# EAGLE design HM11 Breakout (EAGLE 9.6.2)
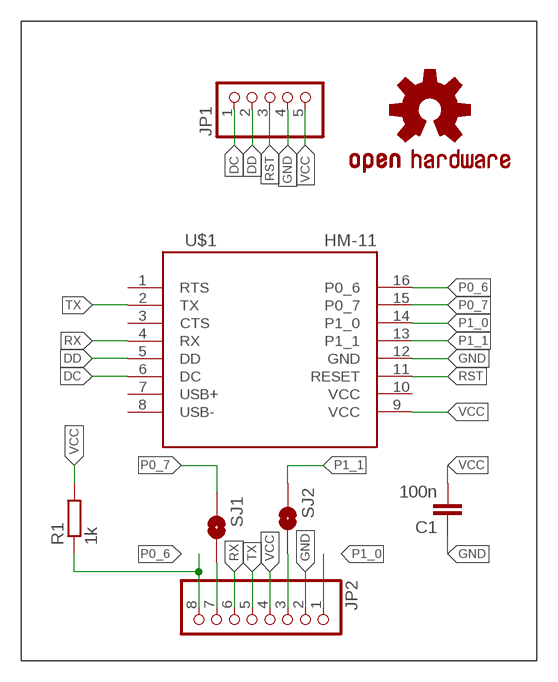
[diagram p0: schematic, sheet 1]

## Parts
C1  100n  C-EU1206  [1206]
JP1  PINHD-1X5  [1X05]
JP2  PINHD-1X8  [1X08]
LOGO1  OSHW-LOGOM  [OSHW-LOGO-M]
R1  1k  R-EU_R1206  [R1206]
SJ1  SOLDERJUMPERTRACE  [SJ_2S-TRACE]
SJ2  SOLDERJUMPERTRACE  [SJ_2S-TRACE]
U$1  HM-11  [HM-11]

## Nets
DC: JP1.1 U$1.6(DC)
DD: JP1.2 U$1.5(DD)
GND: C1.1 JP1.4 JP2.2 U$1.12(GND)
N$1: JP2.7 SJ1.1
N$6: JP2.3 SJ2.1
P0_6: JP2.8 R1.1 U$1.16(P0_6)
P0_7: SJ1.2 U$1.15(P0_7)
P1_0: JP2.1 U$1.14(P1_0)
P1_1: SJ2.2 U$1.13(P1_1)
RST: JP1.3 U$1.11(RESET)
RX: JP2.6 U$1.4(RX)
TX: JP2.5 U$1.2(TX)
VCC: C1.2 JP1.5 JP2.4 R1.2 U$1.9(VCC)
Unconnected: U$1.1(RTS) U$1.3(CTS) U$1.7(USB+) U$1.8(USB-) U$1.10(VCC)

## Library data of the parts
C1 = Master 2016:C-EU: CAPACITOR, European symbol
JP1 = pinhead:PINHD-1X5: PIN HEADER
JP2 = pinhead:PINHD-1X8: PIN HEADER
LOGO1 = Master 2016:OSHW-LOGO: Open Source Hardware Logo This logo indicates the piece of hardware it is found on incorporates a OSHW license and/or adheres to the definition of open source hardware found here: http://freedomdefined.org/OSHW
R1 = rcl:R-EU_: RESISTOR, European symbol; SPICEPREFIX: R
SJ1 SJ2 = Master 2016:SOLDERJUMPER: Solder Jumper Standard SMD solder jumper. Used to automate production. Two varients : Normally Open and Normally Closed are the same, but have different paste layers. NC will have a large amount of paste and should jumper during reflow.
U$1 = SMD Stamp Modules:HM-11

## Board
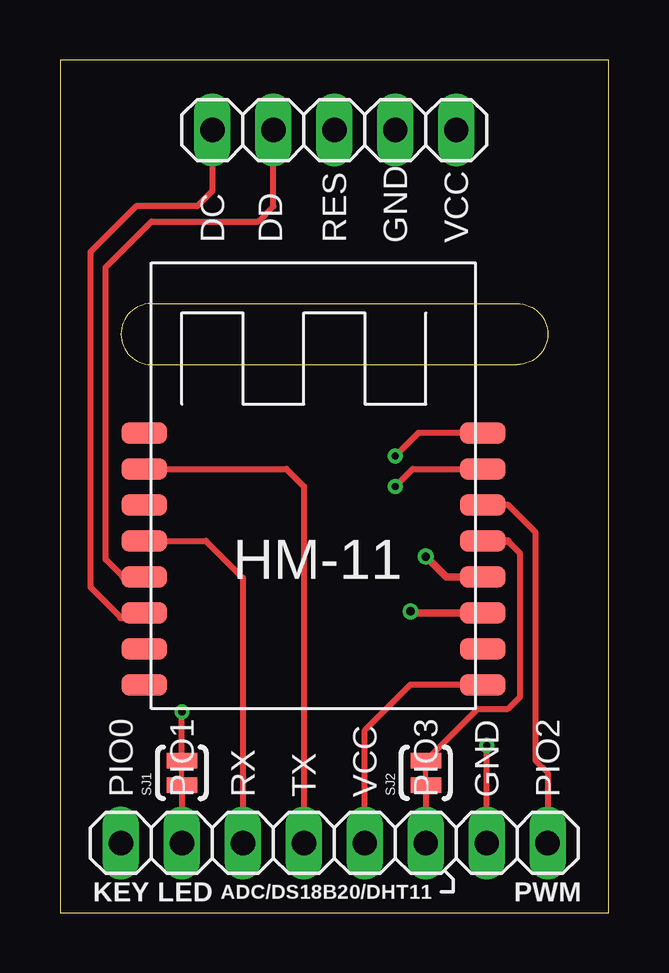
[diagram p1: board, top side]
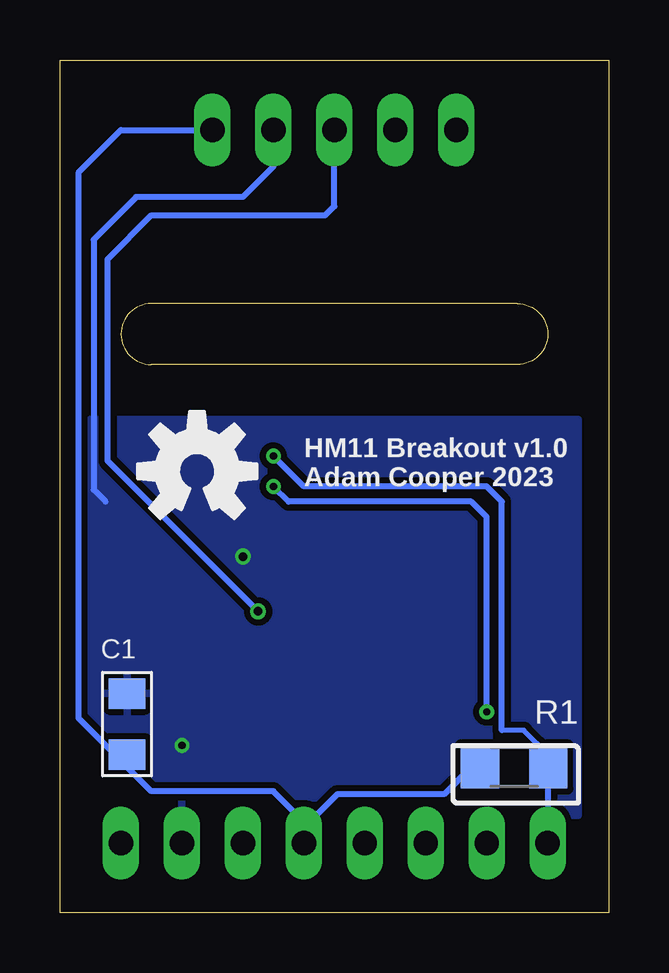
[diagram p2: board, bottom side, seen from below]

Size 22.86 x 35.56 mm. Coordinates in mm from the lower left corner, seen from the top.
Outline: 0,0 22.86,0 22.86,35.56 0,35.56 0,0
Copper layers (1*16): Top 0.035mm / dielectric 1.5mm / Bottom 0.035mm
Design rules "Seeed Fusion_eagle_rule_v1.1": minimum track width 6mil, minimum drill 12mil, track to track 6mil, track to pad 6mil, pad to pad 6mil, via to via 6mil, smd to smd 0mil, copper to edge 10mil, drill to drill 10mil, minimum pad ring 10mil, minimum via ring 6mil, stop-mask expansion 2mil, vias tented up to drill 100mil, thermal gap 10mil
Milling: 4 lines

### Footprints (pad centres in the part's own frame; a part is rotated, then mirrored left to right if it is on the bottom)
1206 = smd 1.27 x 1.524: 1 -1.27,0; 2 1.27,0
1X05 = drill 1.016 long: 1 -5.08,0; 2 -2.54,0; 3 0,0; 4 2.54,0; 5 5.08,0
1X08 = drill 1.016 long: 1 -8.89,0; 2 -6.35,0; 3 -3.81,0; 4 -1.27,0; 5 1.27,0; 6 3.81,0; 7 6.35,0; 8 8.89,0
R1206 = smd 1.6 x 1.803: 1 -1.422,0; 2 1.422,0
SJ_2S-TRACE = smd 0.635 x 1.27: 1 -0.508,0; 2 0.508,0
HM-11 = smd 1.9 x 0.9: 1 -0.3,11.5; 2 -0.3,10; 3 -0.3,8.5; 4 -0.3,7; 5 -0.3,5.5; 6 -0.3,4; 7 -0.3,2.5; 8 -0.3,1; 9 13.8,1; 10 13.8,2.5; 11 13.8,4; 12 13.8,5.5; 13 13.8,7; 14 13.8,8.5; 15 13.8,10; 16 13.8,11.5

### Placement (x,y rotation side)
C1  20.07,7.87 270 bottom
JP1  11.43,32.64 0 top
JP2  11.43,2.92 180 top
LOGO1  17.14,18.41 0 bottom
R1  3.94,6.1 180 bottom
SJ1  5.08,5.84 90 top
SJ2  15.24,5.84 90 top
U$1  3.81,8.51 0 top

### Tracks (layer width: path | path; a pad name or v marks a point on that pad's centre or on a via)
DC
  Top 0.254: JP1.1 6.35,30.1 5.71,29.46 3.17,29.46 1.27,27.56 1.27,13.59 2.54,12.32
  Top 0.305: 2.54,12.32 3.32,12.32 U$1.6
DD
  Top 0.254: 2.63,14.01 1.91,14.73 1.91,26.92 3.81,28.83 8.26,28.83 8.89,29.46 JP1.2
  Top 0.305: U$1.5 2.63,14.01
GND  (via drill 0.3 pad 0.61, 0.35 pad 0.61)
  Top 0.254: JP2.2 v17.78,6.99
  Top 0.305: U$1.12 16.09,14.01 v15.24,14.86
  Bottom 0.254: JP1.4 13.97,31.11 15.24,29.84 19.68,29.84 21.46,28.07 21.46,17.65 20.95,17.14
  pour Bottom (isolate 0.254): 1.27,4.06 1.27,20.57 21.59,20.57 21.59,4.06
N$1
  Top 0.254: SJ1.1 JP2.7
N$6
  Top 0.254: SJ2.1 JP2.3
P0_6  (via drill 0.3 pad 0.61)
  Top 0.254: U$1.16 14.93,20.01 v13.97,19.05
  Bottom 0.203: JP2.8 2.52,2.95 | R1.1 2.52,6.6 3.53,7.62 4.45,7.62
  Bottom 0.254: v13.97,19.05 12.7,17.78 5.08,17.78 4.45,17.14 4.45,7.62 | 2.52,2.95 R1.1
P0_7  (via drill 0.3 pad 0.61)
  Top 0.254: SJ1.2 v5.08,8.38 | v13.97,17.78 14.7,18.51 U$1.15
  Bottom 0.254: v5.08,8.38 5.08,16.51 5.71,17.14 13.34,17.14 v13.97,17.78
P1_0
  Top 0.254: U$1.14 18.67,17.02 19.81,15.88 19.81,6.35 20.32,5.84 JP2.1
  Top 0.305: U$1.14
P1_1
  Top 0.254: 18.65,15.51 19.18,14.99 19.18,9.02 18.67,8.51 17.4,8.51 SJ2.2
  Top 0.305: 18.65,15.51 U$1.13
RST  (via drill 0.35 pad 0.61)
  Top 0.305: U$1.11 14.67,12.51 v14.61,12.57
  Bottom 0.254: JP1.3 11.43,29.46 11.81,29.08 19.05,29.08 20.88,27.26 20.88,18.84 v14.61,12.57
RX
  Top 0.254: JP2.6 7.62,13.97 6.08,15.51 U$1.4
TX
  Top 0.254: JP2.5 10.16,17.78 9.43,18.51 U$1.2
VCC
  Top 0.254: 17.59,9.53 14.61,9.53 12.7,7.62 JP2.4
  Top 0.305: 17.59,9.53 U$1.9
  Bottom 0.152: 22.1,8.13 20.57,6.6 20.32,6.6 | 20.32,6.6 C1.2 | 19.05,5.08 20.32,6.35 20.32,6.6
  Bottom 0.254: JP1.5 20.32,32.64 22.1,30.86 22.1,8.13 19.05,5.08 13.97,5.08 12.7,3.81 JP2.4 12.7,3.56 11.3,4.95 6.86,4.95 5.71,6.1 R1.2

### Text on the board
tPlace: DC | DD | RES | GND | VCC | PIO0 | PIO1 | RX | TX | VCC | PIO3 | GND | PIO2 | KEY | LED | ADC/DS18B20/DHT11 | PWM
bNames: HM11 Breakout v1.0 / Adam Cooper 2023